# EAGLE design MAIN (EAGLE 9.6.2)
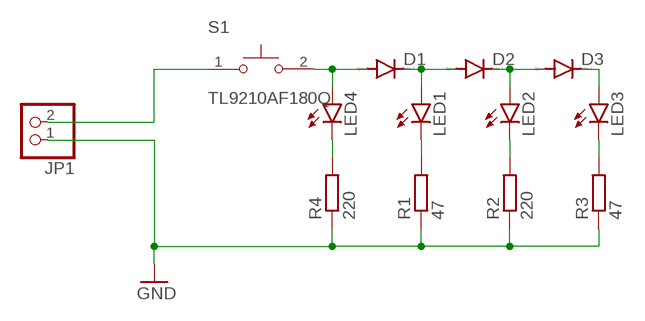
[diagram p0: schematic, sheet 1]

## Parts
D1  DIODE-SMB  [SMB]
D2  DIODE-SMB  [SMB]
D3  DIODE-SMB  [SMB]
JP1  PINHD-1X2  [1X02]
LED1  LED5MM  [LED5MM]
LED2  LED5MM  [LED5MM]
LED3  LED5MM  [LED5MM]
LED4  LED5MM  [LED5MM]
R1  47  R-EU_R0805  [R0805]
R2  220  R-EU_R0805  [R0805]
R3  47  R-EU_R0805  [R0805]
R4  220  R-EU_R0805  [R0805]
S1  TL9210AF180Q  [SW_TL9210AF180Q]

## Nets
GND: JP1.1 R1.1 R2.1 R3.1 R4.1
N$1: D1.C D2.A LED1.A
N$2: D2.C D3.A LED2.A
N$3: D3.C LED3.A
N$4: D1.A LED4.A S1.2
N$5: LED4.K(C) R4.2
N$6: LED1.K(C) R1.2
N$7: LED2.K(C) R2.2
N$8: LED3.K(C) R3.2
N$10: JP1.2 S1.1

## Library data of the parts
D1-D3 = diode:DIODE-: DIODE
JP1 = pinhead:PINHD-1X2: PIN HEADER
LED1-LED4 = led:LED: LED OSRAM: - CHIPLED LG R971, LG N971, LY N971, LG Q971, LY Q971, LO R971, LY R971 LH N974, LH R974 LS Q976, LO Q976, LY Q976 LO Q996 - Hyper CHIPLED LW Q18S LB Q993, LB Q99A, LB R99A - SideLED LS A670, LO A670, LY A670, LG A670, LP A670 LB A673, LV A673, LT A673, LW A673 LH A674 LY A675 LS A676, LA A676, LO A676, LY A676, LW A676 LS A679, LY A679, LG A679 - Hyper Micro SIDELED® LS Y876, LA Y876, LO Y876, LY Y876 LT Y87S - SmartLED LW L88C, LW L88S LB L89C, LB L89S, LG L890 LS L89K, LO L89K, LY L89K LS L896, LA L896, LO L896, LY L896 - TOPLED LS T670, LO T670, LY T670, LG T670, LP T670 LSG T670, LSP T670, LSY T670, LOP T670, LYG T670 LG T671, LOG T671, LSG T671 LB T673, LV T673, LT T673, LW T673 LH T674 LS T676, LA T676, LO T676, LY T676, LB T676, LH T676, LSB T676, LW T676 LB T67C, LV T67C, LT T67C, LS T67K, LO T67K, LY T67K, LW E67C LS E67B, LA E67B, LO E67B, LY E67B, LB E67C, LV E67C, LT E67C LW T67C LS T679, LY T679, LG T679 LS T770, LO T770, LY T770, LG T770, LP T770 LB T773, LV T773, LT T773, LW T773 LH T774 LS E675, LA E675, LY E675, LS T675 LS T776, LA T776, LO T776, LY T776, LB T776 LHGB T686 LT T68C, LB T68C - Hyper Mini TOPLED® LB M676 - Mini TOPLED Santana® LG M470 LS M47K, LO M47K, LY M47K Source: http://www.osram.convergy.de LUXEON: - LUMILED® LXK2-PW12-R00, LXK2-PW12-S00, LXK2-PW14-U00, LXK2-PW14-V00 LXK2-PM12-R00, LXK2-PM12-S00, LXK2-PM14-U00 LXK2-PE12-Q00, LXK2-PE12-R00, LXK2-PE12-S00, LXK2-PE14-T00, LXK2-PE14-U00 LXK2-PB12-K00, LXK2-PB12-L00, LXK2-PB12-M00, LXK2-PB14-N00, LXK2-PB14-P00, LXK2-PB14-Q00 LXK2-PR12-L00, LXK2-PR12-M00, LXK2-PR14-Q00, LXK2-PR14-R00 LXK2-PD12-Q00, LXK2-PD12-R00, LXK2-PD12-S00 LXK2-PH12-R00, LXK2-PH12-S00 LXK2-PL12-P00, LXK2-PL12-Q00, LXK2-PL12-R00 Source: www.luxeon.com KINGBRIGHT: KA-3528ASYC Source: www.kingbright.com
R1-R4 = rcl:R-EU_: RESISTOR, European symbol; SPICEPREFIX: R
S1 = TL9210AF180Q:TL9210AF180Q: Tactile Switch SPST-NO Top Actuated Surface Mount Check prices <https://pricing.snapeda.com/parts/TL9210AF180Q/E-Switch/view-part?ref=eda>; AVAILABILITY: In Stock; DESCRIPTION: Tactile Switch SPST-NO Top Actuated Surface Mount; MF: E-Switch; MP: TL9210AF180Q; PACKAGE: None; PRICE: None

## Board
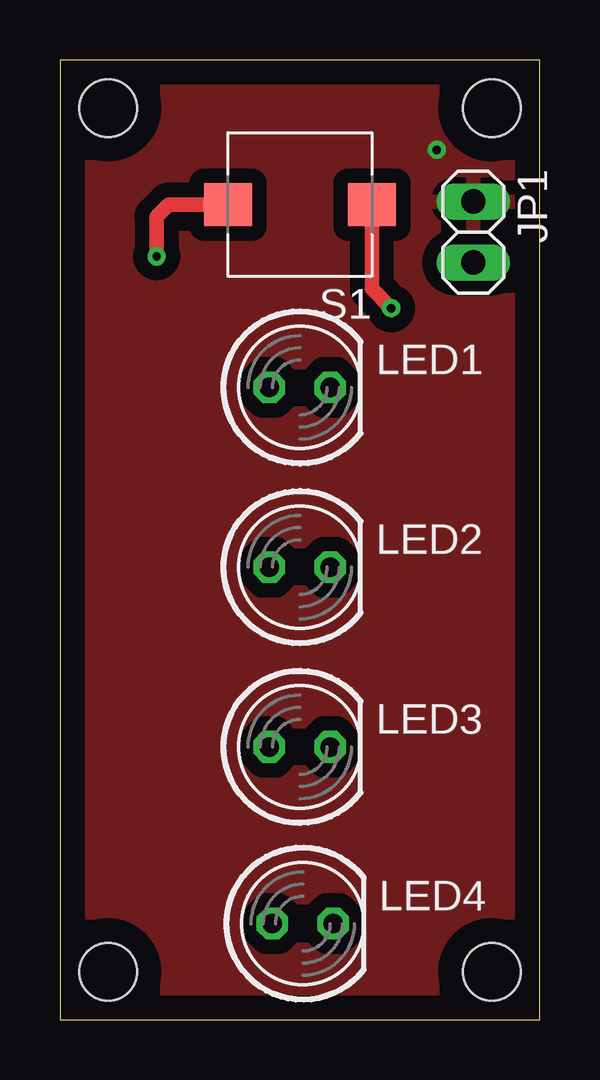
[diagram p1: board, top side]
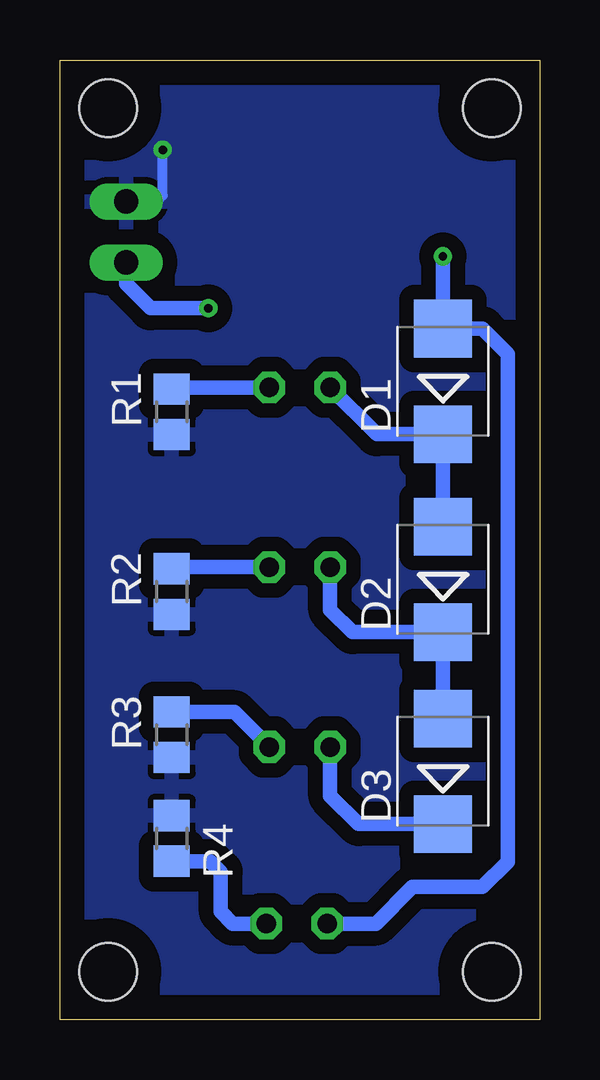
[diagram p2: board, bottom side, seen from below]

Size 20 x 40 mm. Coordinates in mm from the lower left corner, seen from the top.
Outline: 0,0 20,0 20,40 0,40 0,0
Copper layers (1*16): Top 0.035mm / dielectric 1.5mm / Bottom 0.035mm
Design rules "default": minimum track width 6mil, minimum drill 0.35mm, track to track 6mil, track to pad 6mil, pad to pad 6mil, via to via 6mil, smd to smd 6mil, copper to edge 40mil, drill to drill 6mil, minimum pad ring 10mil, minimum via ring 8mil, stop-mask expansion 4mil, vias tented up to drill 0mil, thermal gap 10mil
Holes 2.4 mm at 2,38 18,2 18,38 2,2

### Footprints (pad centres in the part's own frame; a part is rotated, then mirrored left to right if it is on the bottom)
SMB = smd 2.4 x 2.4: A 2.2,0; C -2.2,0
1X02 = drill 1.016 long: 1 -1.27,0; 2 1.27,0
LED5MM = drill 0.813 octagon: A -1.27,0; K 1.27,0
R0805 = smd 1.3 x 1.5: 1 -0.95,0; 2 0.95,0
SW_TL9210AF180Q = smd 2 x 1.8: 1 -3,0; 2 3,0

### Placement (x,y rotation side)
D1  4.03,26.6 90 bottom
D2  4.03,18.35 90 bottom
D3  4.03,10.35 90 bottom
JP1  17.24,32.83 270 top
LED1  10,26.35 0 top
LED2  10,18.86 0 top
LED3  10,11.36 0 top
LED4  10.13,4 0 top
R1  15.33,25.33 90 bottom
R2  15.33,17.84 90 bottom
R3  15.33,11.87 90 bottom
R4  15.33,7.55 270 bottom
S1  10,33.97 180 top

### Tracks (layer width: path | path; a pad name or v marks a point on that pad's centre or on a via)
GND  (via drill 0.35)
  Bottom 0.406: v15.71,36.26 15.71,34.35 15.97,34.1 JP1.1
  pour Bottom (isolate 0.61): -0.03,39.81 -0.03,-0.07 19.91,-0.07 19.91,39.81
  pour Top (isolate 0.61): 0.09,39.94 0.09,0.06 19.91,0.06 19.91,39.94
N$1
  Bottom 0.61: LED1.A 6.78,24.4 D1.C D2.A
N$2
  Bottom 0.61: LED2.A 8.73,17.08 7.8,16.15 D2.C D3.A
N$3
  Bottom 0.61: D3.C 7.55,8.15 8.73,9.33 LED3.A
N$4  (via drill 0.35)
  Top 0.61: S1.2 4.54,33.97 4.03,33.46 v4.03,31.81
  Bottom 0.61: v4.03,31.81 D1.A 2.38,28.8 1.32,27.75 1.32,6.58 2.38,5.52 5.3,5.52 6.83,4 LED4.A
N$5
  Bottom 0.61: LED4.K 12.79,4 13.3,4.51 13.3,6.16 13.75,6.6 R4.2
N$6
  Bottom 0.61: LED1.K 15.27,26.35 R1.2
N$7
  Bottom 0.61: LED2.K 15.27,18.86 R2.2
N$8
  Bottom 0.61: LED3.K 12.73,12.82 R3.2
N$10  (via drill 0.35)
  Top 0.61: v13.81,29.65 13,30.46 S1.1
  Bottom 0.61: JP1.2 17.24,30.67 16.22,29.65 v13.81,29.65